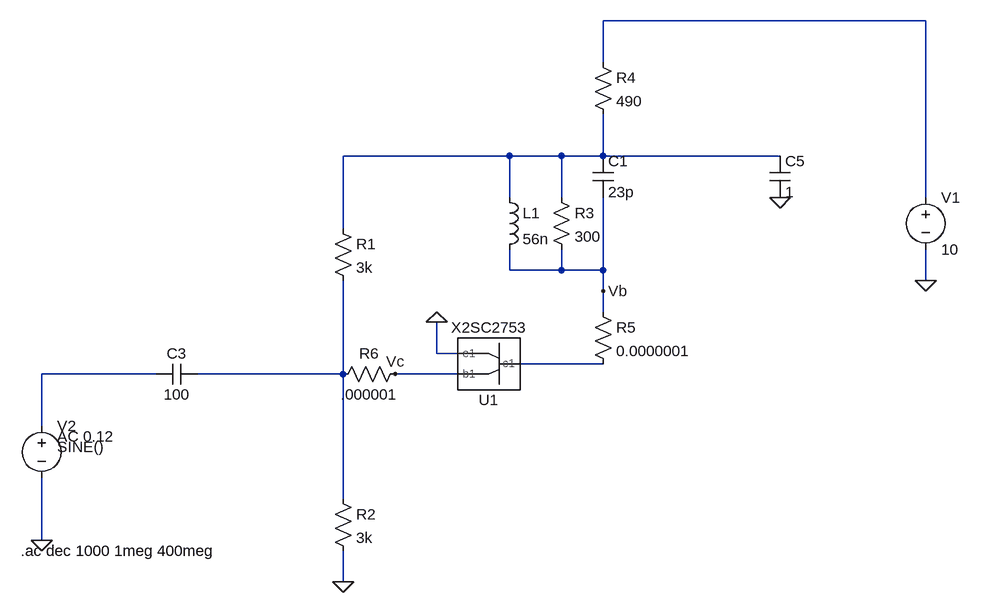
[diagram p0: schematic Narrowband.asc]
Narrowband.asc, the LTspice schematic file:
Version 4
SHEET 1 880 680
WIRE 688 -464 192 -464
WIRE 192 -400 192 -464
WIRE 48 -256 -208 -256
WIRE 128 -256 48 -256
WIRE 192 -256 192 -320
WIRE 192 -256 128 -256
WIRE 464 -256 192 -256
WIRE 48 -192 48 -256
WIRE 128 -192 128 -256
WIRE 688 -192 688 -464
WIRE -208 -144 -208 -256
WIRE 48 -80 48 -112
WIRE 128 -80 128 -112
WIRE 128 -80 48 -80
WIRE 192 -80 192 -192
WIRE 192 -80 128 -80
WIRE 688 -64 688 -112
WIRE 192 -48 192 -80
WIRE 192 -16 192 -48
WIRE -64 48 -64 0
WIRE -32 48 -64 48
WIRE 192 64 64 64
WIRE -496 80 -672 80
WIRE -208 80 -208 -64
WIRE -208 80 -432 80
WIRE -32 80 -128 80
WIRE -672 160 -672 80
WIRE -208 272 -208 80
WIRE -672 336 -672 240
WIRE -208 400 -208 352
FLAG 688 -64 0
FLAG -672 336 0
FLAG -128 80 Vc
FLAG 192 -48 Vb
FLAG 464 -192 0
FLAG -208 400 0
FLAG -64 0 0
SYMBOL res 176 -416 R0
SYMATTR InstName R4
SYMATTR Value 490
SYMBOL voltage 688 -208 R0
WINDOW 123 0 0 Left 0
WINDOW 39 0 0 Left 0
SYMATTR InstName V1
SYMATTR Value 10
SYMBOL voltage -672 144 R0
WINDOW 123 24 32 Left 2
WINDOW 39 24 64 Left 2
WINDOW 3 24 48 Left 2
SYMATTR Value2 AC 0.12
SYMATTR Value SINE()
SYMATTR InstName V2
SYMBOL cap 448 -256 R0
SYMATTR InstName C5
SYMATTR Value 1
SYMBOL ind 32 -208 R0
SYMATTR InstName L1
SYMATTR Value 56n
SYMBOL cap -432 64 R90
WINDOW 0 0 32 VBottom 2
WINDOW 3 32 32 VTop 2
SYMATTR InstName C3
SYMATTR Value 100
SYMBOL res -224 -160 R0
SYMATTR InstName R1
SYMATTR Value 3k
SYMBOL res -224 256 R0
SYMATTR InstName R2
SYMATTR Value 3k
SYMBOL res 176 -32 R0
SYMATTR InstName R5
SYMATTR Value 0.0000001
SYMBOL res -112 64 R90
WINDOW 0 0 56 VBottom 2
WINDOW 3 32 56 VTop 2
SYMATTR InstName R6
SYMATTR Value .000001
SYMBOL AutoGenerated\\X2SC2753 16 64 R180
SYMATTR InstName U1
SYMBOL res 112 -208 R0
SYMATTR InstName R3
SYMATTR Value 300
SYMBOL cap 176 -256 R0
SYMATTR InstName C1
SYMATTR Value 23p
TEXT -704 352 Left 2 !.ac dec 1000 1meg 400meg

The netlist it stands for:
* Narrowband.asc
R4 N001 N002 490
V1 N001 0 10
V2 N004 0 SINE() AC 0.12
C5 N002 0 1
L1 N002 Vb 56n
C3 N005 N004 100
R1 N002 N005 3k
R2 N005 0 3k
R5 Vb N003 0.0000001
R6 Vc N005 .000001
XU1 N003 Vc 0 X2SC2753  ; pins c1 b1 e1
R3 N002 Vb 300
C1 N002 Vb 23p
.ac dec 1000 1meg 400meg
.lib C:/Users/jonathansharir-smith/Desktop/251SPICE/Lab2/narrowband\2SC2753.lib
.backanno
.end